# EAGLE design Arduino speed controller (EAGLE 9.0.1)
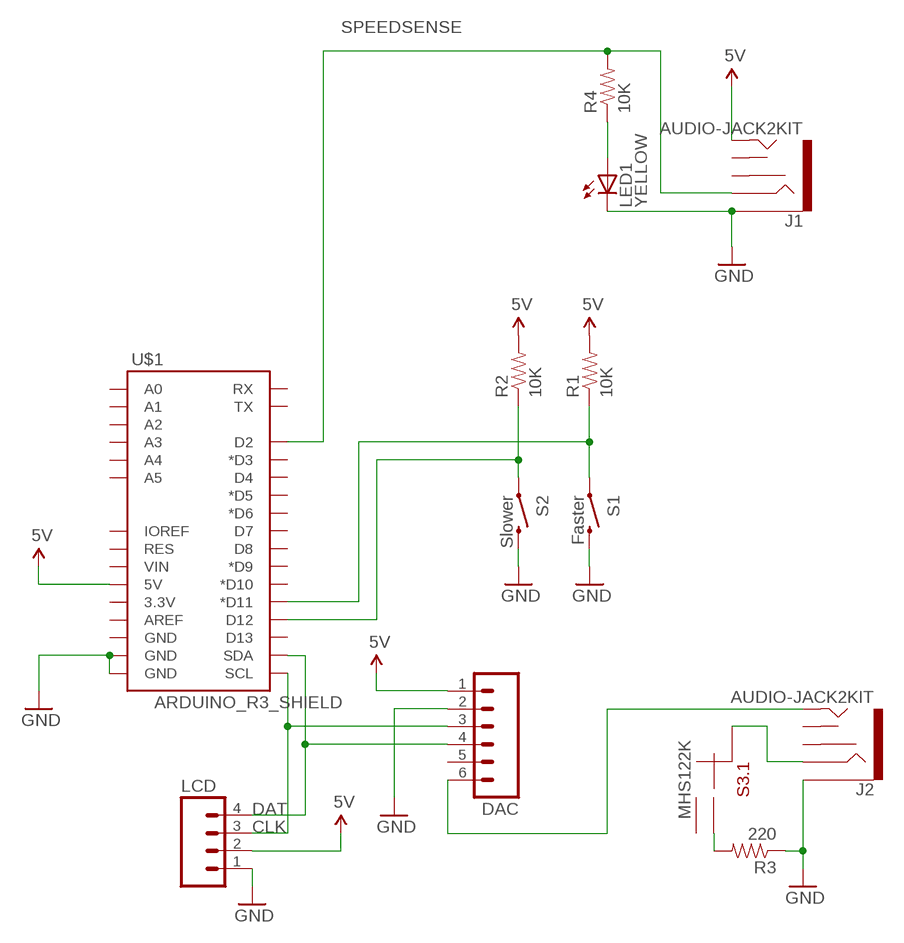
[diagram p0: schematic, sheet 1]

## Parts
DAC  M06SIP  [1X06]
J1  AUDIO-JACK2KIT  [AUDIO-JACK-KIT]
J2  AUDIO-JACK2KIT  [AUDIO-JACK-KIT]
LCD  M04PTH  [1X04]
LED1  YELLOW  LED3MM  [LED3MM]
R1  10K  RESISTORPTH-1/4W  [AXIAL-0.4]
R2  10K  RESISTORPTH-1/4W  [AXIAL-0.4]
R3  220  RESISTORPTH-1/4W  [AXIAL-0.4]
R4  10K  RESISTORPTH-1/4W  [AXIAL-0.4]
S1  Faster  SWITCH-MOMENTARY-2PTH  [TACTILE-PTH]
S2  Slower  SWITCH-MOMENTARY-2PTH  [TACTILE-PTH]
S3  MHS122K  [APEM-MHS122K]
U$1  ARDUINO_R3_SHIELD  [UNO_R3_SHIELD]

## Nets
5V: DAC.1 J1.TIP LCD.2 R1.P$2 R2.P$2 U$1.5V
CLK: DAC.3 LCD.3 U$1.SCL
DAT: DAC.4 LCD.4 U$1.SDA
FASTER: R1.P$1 S1.1 U$1.D11(*D11)
GND: DAC.2 J1.SLEEVE J2.SLEEVE LCD.1 LED1.K(C) R3.P$1 S1.3 S2.3 U$1.GND@0(GND) U$1.GND@1(GND)
N$1: J2.RING S3.CMN(.1:CM)
N$2: R3.P$2 S3.1
N$3: DAC.6 J2.TIP
N$8: LED1.A R4.P$1
SLOWER: R2.P$1 S2.1 U$1.D12
SPEEDSENSE: J1.RING R4.P$2 U$1.D2
Unconnected: DAC.5 J1.RSH J1.TSH J2.RSH J2.TSH S3.1' S3.2 S3.2' S3.CMN'(.2:CM) U$1.3.3V U$1.A0 U$1.A1 U$1.A2 U$1.A3 U$1.A4 U$1.A5 U$1.AREF U$1.D3(*D3) U$1.D4 U$1.D5(*D5) U$1.D6(*D6) U$1.D7 U$1.D8 U$1.D9(*D9) U$1.D10(*D10) U$1.D13 U$1.GND@2(GND) U$1.IOREF U$1.RES U$1.RX U$1.TX U$1.VIN

## Library data of the parts
DAC = SparkFun-Connectors:M06: Header 6 Standard 6-pin 0.1" header. Use with straight break away headers (SKU : PRT-00116), right angle break away headers (PRT-00553), swiss pins (PRT-00743), machine pins (PRT-00117), and female headers (PRT-00115). Molex polarized connector foot print use with SKU : PRT-08094 with associated crimp pins and housings. NOTES ON THE VARIANTS LOCK and LOCK_LONGPADS... This footprint was designed to help hold the alignment of a through-hole component (i.e. 6-pin header) while soldering it into place. You may notice that each hole has been shifted either up or down by 0.005 of an inch from it's more standard position (which is a perfectly straight line). This slight alteration caused the pins (the squares in the middle) to touch the edges of the holes. Because they are alternating, it causes a "brace" to hold the component in place. 0.005 has proven to be the perfect amount of "off-center" position when using our standard breakaway headers. Although looks a little odd when you look at the bare footprint, once you have a header in there, the alteration is very hard to notice. Also,if you push a header all the way into place, it is covered up entirely on the bottom side. This idea of altering the position of holes to aid alignment will be further integrated into the Sparkfun Library for other footprints. It can help hold any component with 3 or more connection pins.
J1 J2 = SparkFun-Connectors:AUDIO-JACK2: Stereo audio jack with bypass switches. SMT version used on LilyPad MP3 board.; PROD_ID: CONN-08774
LCD = SparkFun-Connectors:M04: Header 4 Standard 4-pin 0.1" header. Use with straight break away headers (SKU : PRT-00116), right angle break away headers (PRT-00553), swiss pins (PRT-00743), machine pins (PRT-00117), and female headers (PRT-00115). Molex polarized connector foot print use with SKU : PRT-08231 with associated crimp pins and housings. 1MM SMD Version SKU: PRT-10208
LED1 = SparkFun-LED:LED: LEDs Standard schematic elements and footprints for 5mm, 3mm, 1206, and 0603 sized LEDs. 5mm - Spark Fun Electronics SKU : COM-00529 (and others)
R1-R4 = SparkFun-Passives:RESISTOR: Resistor Basic schematic elements and footprints for 0603, 1206, and PTH resistors.
S1 S2 = SparkFun-Electromechanical:SWITCH-MOMENTARY-2: Various NO switches- pushbuttons, reed, etc
S3 = switches:MHS122K; MOUSER: 642-MHS122K
U$1 = SparkFun-Boards:ARDUINO_R3_SHIELD: Shield form compatible with the Arduino Uno R3.

## Board
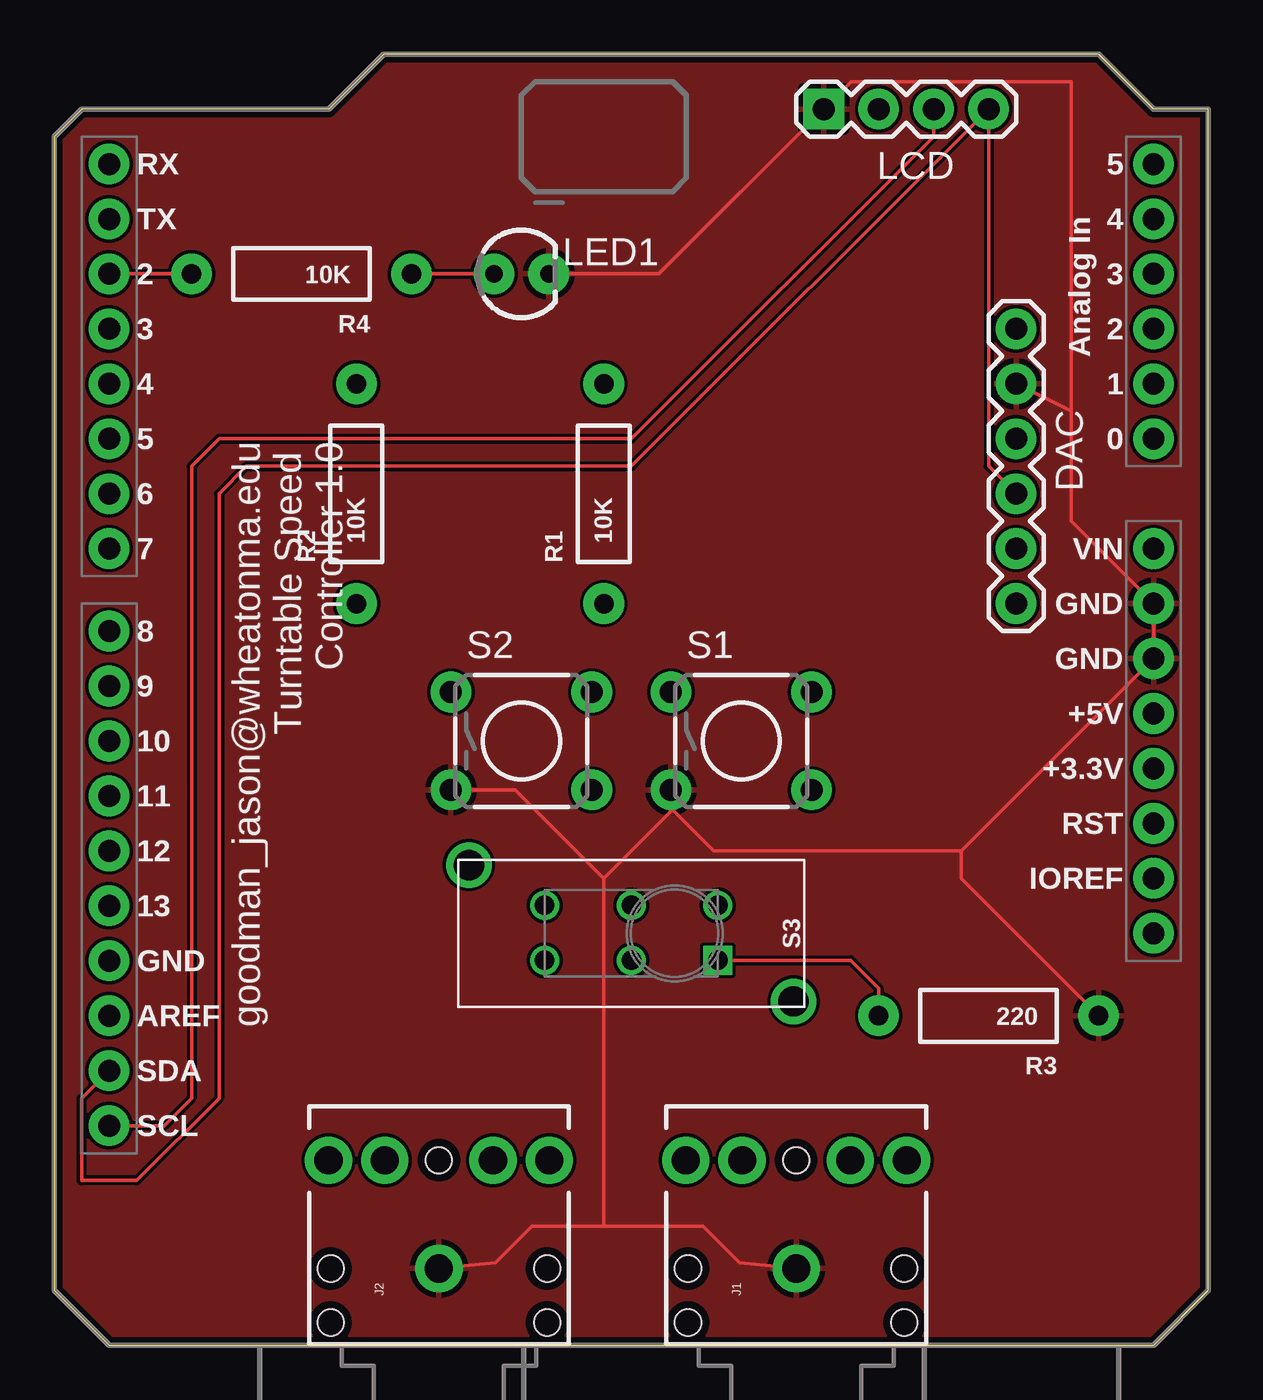
[diagram p1: board, top side]
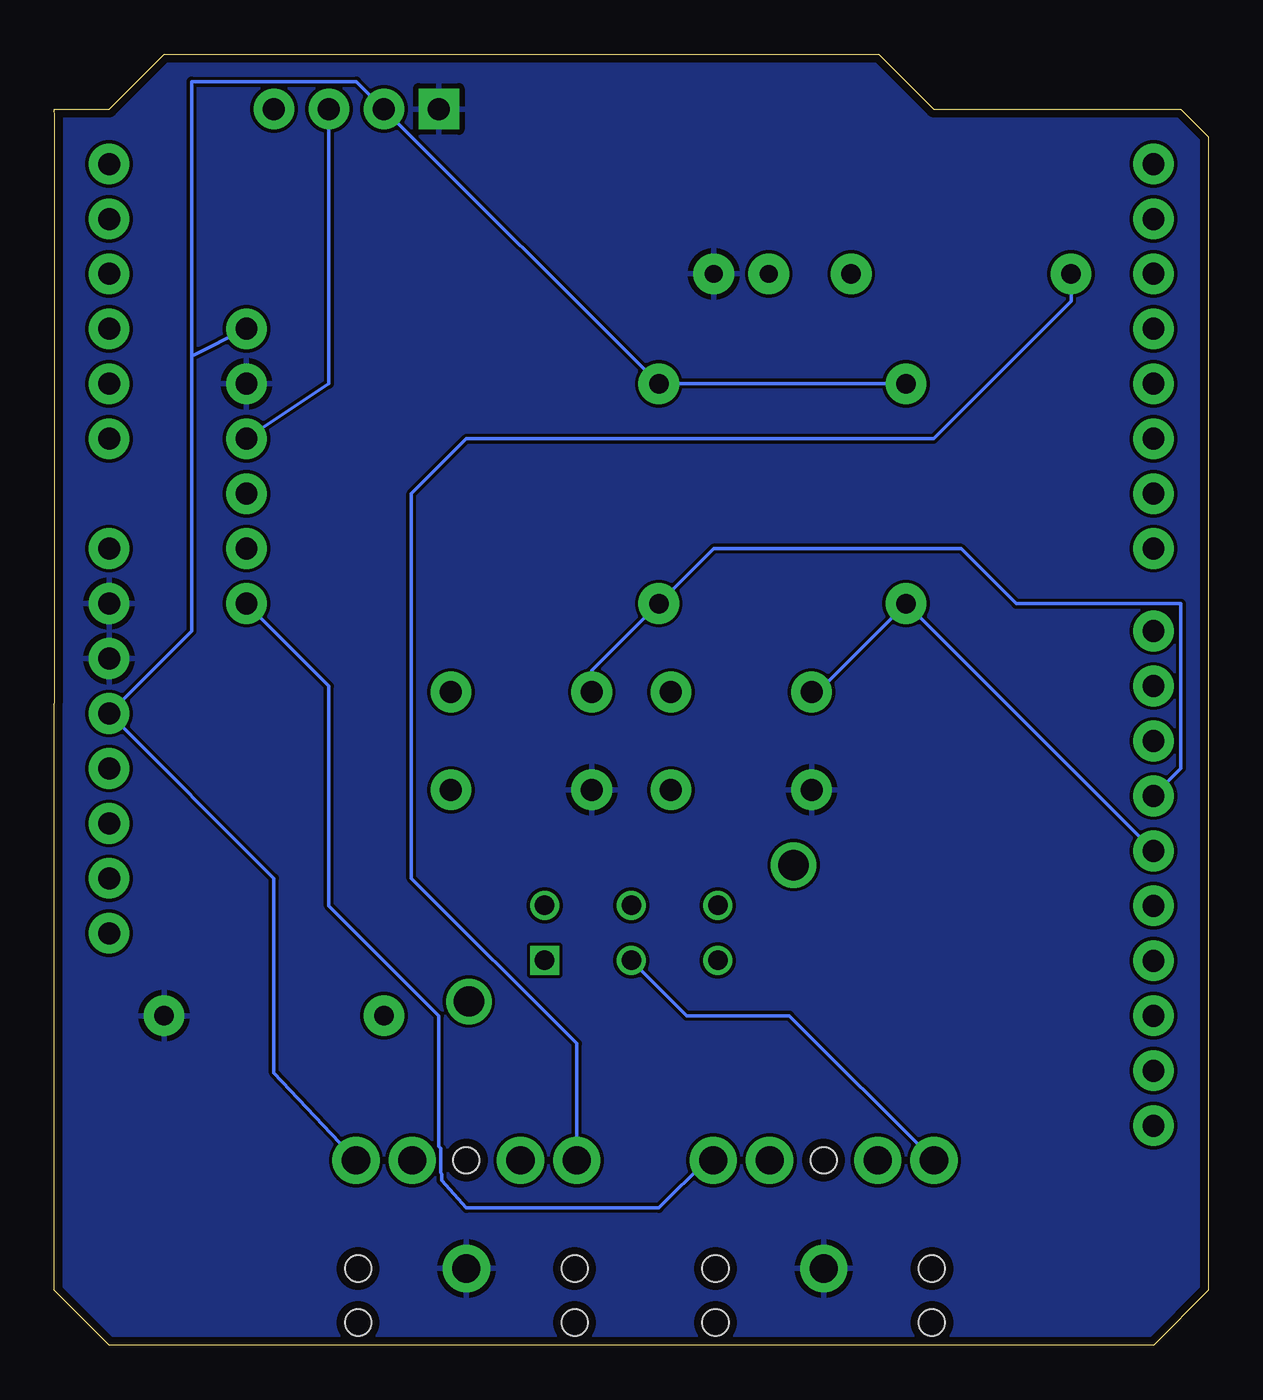
[diagram p2: board, bottom side, seen from below]

Size 53.34 x 59.69 mm. Coordinates in mm from the lower left corner, seen from the top.
Outline: 2.54,0 50.8,0 53.34,2.54 53.32,56.82 53.34,57.15 50.8,57.15 48.26,59.69 15.24,59.69 12.7,57.15 1.27,57.15 0,55.88 0,2.54 2.54,0
Copper layers (1*16): Top 0.035559375mm / dielectric 1.6mm / Bottom 0.035559375mm
Design rules "oshpark-2layer": minimum track width 6mil, minimum drill 10mil, track to track 6mil, track to pad 6mil, pad to pad 6mil, via to via 6mil, smd to smd 6mil, copper to edge 15mil, drill to drill 6mil, minimum pad ring 5mil, minimum via ring 5mil, stop-mask expansion 2.5mil, vias tented up to drill 0mil, thermal gap 10mil

### Footprints (pad centres in the part's own frame; a part is rotated, then mirrored left to right if it is on the bottom)
1X06 = drill 1.016 pad 1.88: 1 0,0; 2 2.54,0; 3 5.08,0; 4 7.62,0; 5 10.16,0; 6 12.7,0
AUDIO-JACK-KIT = drill 1.3 pad 2.184: RING 5,5.1; RSH 5,2.5; SLEEVE 0,0; TIP 5,-5.1; TSH 5,-2.5 | hole 1.2: 0,5; -2.5,5; -2.5,-5; 0,-5; 5,0
1X04 = drill 1.016 pad 1.88 square: 1 0,0 | drill 1.016 pad 1.88: 2 2.54,0; 3 5.08,0; 4 7.62,0
LED3MM = drill 0.813 pad 1.88: A -1.27,0; K 1.27,0
AXIAL-0.4 = drill 0.9 pad 1.88: P$1 -5.08,0; P$2 5.08,0
TACTILE-PTH = drill 1.016 pad 1.88: 1 -3.251,2.261; 2 3.251,2.261; 3 -3.251,-2.261; 4 3.251,-2.261
APEM-MHS122K = drill 0.9 square: 1 -4,1.25 | drill 0.9: 1' -4,-1.29; 2 4,1.25; 2' 4,-1.29; CMN 0,1.25; CMN' 0,-1.29 | drill 1.4: S1 -7.5,3.15; S2 7.5,-3.15
UNO_R3_SHIELD = drill 1.016 pad 1.88: 3.3V 50.8,26.67; 5V 50.8,29.21; A0 50.8,41.91; A1 50.8,44.45; A2 50.8,46.99; A3 50.8,49.53; A4 50.8,52.07; A5 50.8,54.61; AREF 2.54,15.24; D2 2.54,49.53; D3 2.54,46.99; D4 2.54,44.45; D5 2.54,41.91; D6 2.54,39.37; D7 2.54,36.83; D8 2.54,33.02; D9 2.54,30.48; D10 2.54,27.94; D11 2.54,25.4; D12 2.54,22.86; D13 2.54,20.32; GND@0 50.8,31.75; GND@1 50.8,34.29; GND@2 2.54,17.78; IOREF 50.8,21.59; NC 50.8,19.05; RES 50.8,24.13; RX 2.54,54.61; SCL 2.54,10.16; SDA 2.54,12.7; TX 2.54,52.07; VIN 50.8,36.83

### Placement (x,y rotation side)
DAC  44.45,46.99 270 top
J1  34.29,3.56 90 top
J2  17.78,3.56 90 top
LCD  35.56,57.15 0 top
LED1  21.59,49.53 0 top
R1  25.4,39.37 90 top
R2  13.97,39.37 90 top
R3  43.18,15.24 180 top
R4  11.43,49.53 180 top
S1  31.75,27.94 0 top
S2  21.59,27.94 0 top
S3  26.67,19.05 180 top
U$1  0,0 0 top

### Tracks (layer width: path | path; a pad name or v marks a point on that pad's centre or on a via)
5V
  Bottom 0.152: R2.P$2 R1.P$2 LCD.2 39.37,58.42 46.99,58.42 46.99,45.72 | J1.TIP 43.18,12.6 43.18,21.59 U$1.5V 46.99,33.02 46.99,45.72 | DAC.1 46.99,45.72
CLK
  Top 0.152: LCD.3 40.64,55.88 26.67,41.91 7.62,41.91 6.35,40.64 6.35,11.43 5.08,10.16 U$1.SCL
  Bottom 0.152: LCD.3 40.64,44.45 DAC.3
DAT
  Top 0.152: U$1.SDA 1.27,11.43 1.27,7.62 3.81,7.62 7.62,11.43 7.62,39.37 8.89,40.64 26.67,40.64 LCD.4 43.18,40.64 DAC.4
FASTER
  Bottom 0.152: S1.1 28.5,31.19 R1.P$1 22.86,36.83 11.43,36.83 8.89,34.29 1.27,34.29 1.27,26.67 U$1.D11
GND
  Top 0.152: 41.91,22.86 U$1.GND@0 U$1.GND@1 46.99,38.1 46.99,43.18 | 41.91,22.86 30.48,22.86 28.5,24.84 | 28.5,24.84 S1.3 | J2.SLEEVE 20.39,3.81 22.08,5.5 25.4,5.5 | J1.SLEEVE 31.68,3.81 29.99,5.5 25.4,5.5 | 46.99,43.18 46.99,58.42 36.83,58.42 LCD.1 27.94,49.53 LED1.K | DAC.2 46.99,43.18 | R3.P$1 41.91,21.59 41.91,22.86 | 25.4,21.59 28.5,24.69 28.5,24.84 | 25.4,5.5 25.4,21.59 | 25.4,21.59 21.31,25.68 S2.3
  pour Top: 50.8,0 53.34,2.54 53.34,57.15 50.8,57.15 48.26,59.69 15.24,59.69 12.7,57.15 1.27,57.15 0,55.88 0,2.54 2.54,0
  pour Bottom: 0,55.88 1.27,57.15 12.7,57.15 15.24,59.69 48.26,59.69 50.8,57.15 53.34,57.15 53.34,2.54 50.8,0 2.54,0 0,2.54
N$1
  Bottom 0.152: J2.RING 19.36,15.24 24.11,15.24 S3.CMN
N$2
  Top 0.152: S3.1 36.81,17.8 38.1,16.51 R3.P$2
N$3
  Bottom 0.152: J2.TIP 23.19,8.56 25.4,6.35 34.29,6.35 35.43,7.62 35.43,7.92 35.47,8.01 35.47,9.1 35.56,9.19 35.56,15.24 39.37,19.05 40.64,20.32 40.64,30.48 DAC.6
N$8
  Top 0.152: R4.P$1 LED1.A
SLOWER
  Bottom 0.152: 17.5,30.2 17.78,30.2 | 17.78,30.2 S2.1 | 17.78,30.2 17.78,30.48 R2.P$1 U$1.D12
SPEEDSENSE
  Top 0.152: U$1.D2 R4.P$2
  Bottom 0.152: J1.RING 29.19,13.95 36.83,21.59 36.83,39.37 34.29,41.91 12.7,41.91 6.35,48.26 R4.P$2

### Text on the board
_tsilk: goodman_jason@wheatonma.edu / Turntable Speed / Controller 1.0